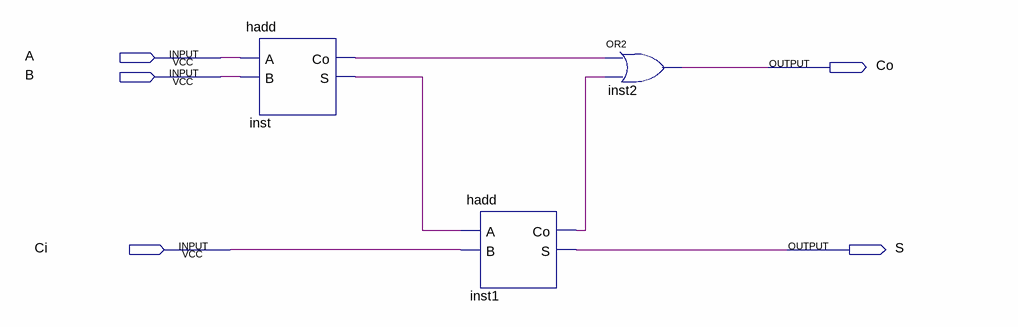
[diagram p0: schematic sheet]
// Quartus schematic fadd.bdf as structural Verilog: 3 symbols, 5 pins
module fadd (
  input  A,
  input  B,
  input  Ci,
  output Co,
  output S
);

  wire inst1_co, inst_co, inst_s;

  hadd inst (.A(A), .B(B), .Co(inst_co), .S(inst_s));
  hadd inst1 (.A(inst_s), .B(Ci), .Co(inst1_co), .S(S));
  or inst2 (Co, inst_co, inst1_co);
endmodule
